# EAGLE schematic led_sub_module (EAGLE 7.6.0)
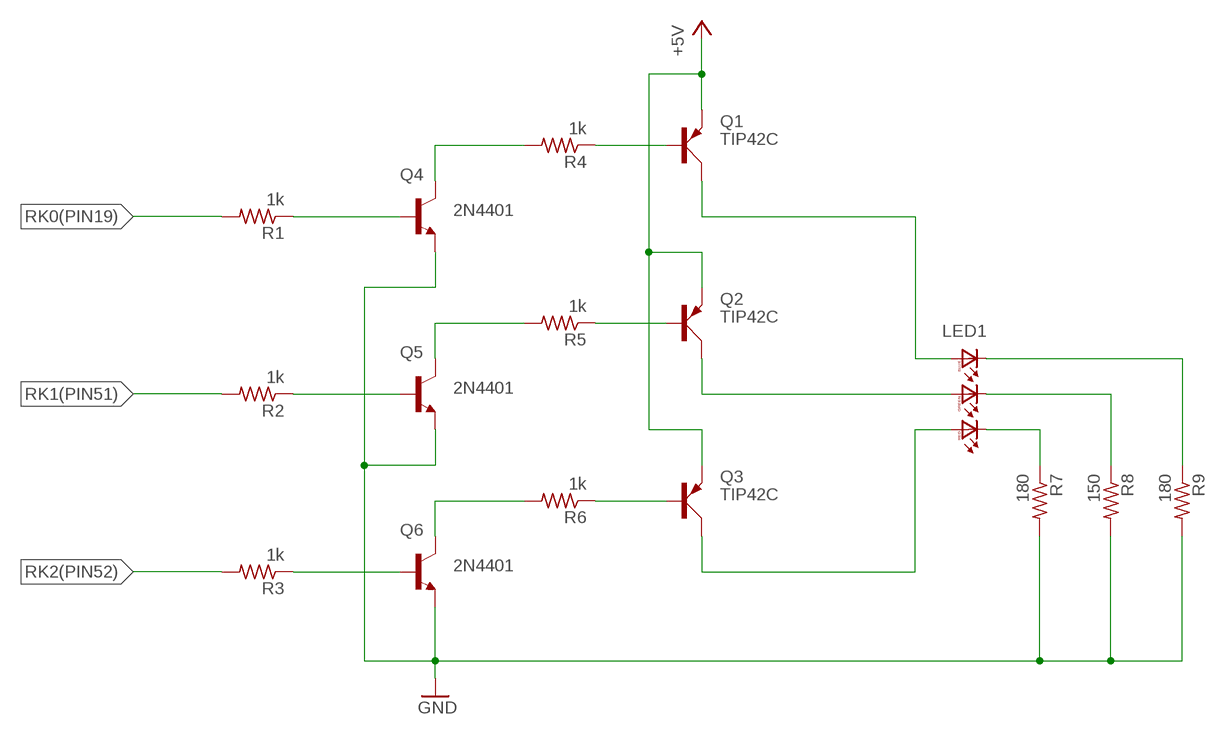
[diagram p0: schematic, sheet 1]

## Parts
LED1  F50360  [F50360]
Q1  TIP42C  [TO220AV]
Q2  TIP42C  [TO220AV]
Q3  TIP42C  [TO220AV]
Q4  2N4401  [TO92-3]
Q5  2N4401  [TO92-3]
Q6  2N4401  [TO92-3]
R1  1k  R-US_0204/2V  [0204V]
R2  1k  R-US_0204/2V  [0204V]
R3  1k  R-US_0204/2V  [0204V]
R4  1k  R-US_0204/2V  [0204V]
R5  1k  R-US_0204/2V  [0204V]
R6  1k  R-US_0204/2V  [0204V]
R7  180  R-US_0204/2V  [0204V]
R8  150  R-US_0204/2V  [0204V]
R9  180  R-US_0204/2V  [0204V]

## Nets
+5V: Q1.E Q2.E Q3.E
GND: Q4.1(E) Q5.1(E) Q6.1(E) R7.2 R8.2 R9.2
N$1: LED1.RC R7.1
N$2: LED1.BA Q1.C
N$3: Q6.3(C) R6.2
N$4: Q5.3(C) R5.2
N$5: Q4.3(C) R4.2
N$6: Q1.B R4.1
N$7: Q2.B R5.1
N$8: Q3.B R6.1
N$9: Q6.2(B) R3.1
N$10: Q5.2(B) R2.1
N$11: Q4.2(B) R1.1
N$12: LED1.GA Q2.C
N$13: LED1.RA Q3.C
N$14: LED1.GC R8.1
N$15: LED1.BC R9.1
RK0(PIN19): R1.2
RK1(PIN51): R2.2
RK2(PIN52): R3.2

## Library data of the parts
LED1 = led:F50360: Full color Z-Power LED RGB P5-II Series Source: http://www.seoulsemicon.co.kr .. F50360.pdf
Q1-Q3 = transistor-power:TIP42C: PNP TRANSISTOR
Q4-Q6 = personal:2N4401
R1-R9 = resistor:R-US_: RESISTOR, American symbol